# Altium schematic sheet SmartBoard.SchDoc
size A4; Organization: HSLU T&A; Address1: Abteilung Elektrotechnik; Address2: Technikumsstrasse 21; Address3: CH-6048 Horw
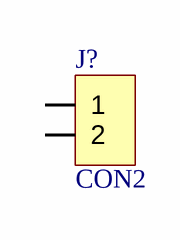
[diagram p0: SmartBoard.SchDoc]

## Parts
J?  CON2

## Nets

Not connected (* = marked no-connect by the designer): J? 1 2

## Notes on the sheet
- Project:
- Drawn by:
- Size:
- Sheet
- A4
- Rev.:
- of
- Date:
- File: